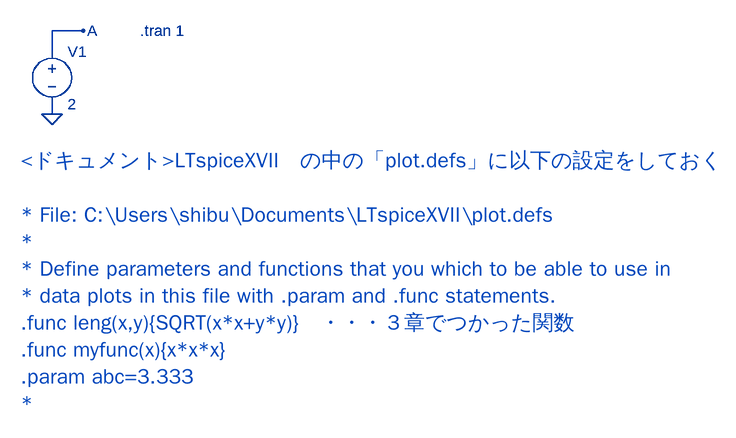
[diagram p0: schematic Fig_4-13_myfunc.asc]
Fig_4-13_myfunc.asc, the LTspice schematic file:
Version 4
SHEET 1 1356 680
WIRE 192 112 144 112
WIRE 144 144 144 112
WIRE 144 240 144 224
FLAG 144 240 0
FLAG 192 112 A
SYMBOL voltage 144 128 R0
WINDOW 3 24 97 Left 2
WINDOW 123 0 0 Left 0
WINDOW 39 0 0 Left 0
SYMATTR Value 2
SYMATTR InstName V1
TEXT 96 312 Left 3 ;<ドキュメント>LTspiceXVII　の中の「plot.defs」に以下の設定をしておく\n \n* File: C:\\Users\\shibu\\Documents\\LTspiceXVII\\plot.defs\n*\n* Define parameters and functions that you which to be able to use in\n* data plots in this file with .param and .func statements.\n.func leng(x,y){SQRT(x*x+y*y)}　・・・３章でつかった関数\n.func myfunc(x){x*x*x}\n.param abc=3.333\n*
TEXT 280 112 Left 2 !.tran 1

The netlist it stands for:
* Fig_4-13_myfunc.asc
V1 A 0 2
* <ドキュメント>LTspiceXVII　の中の「plot.defs」に以下の設定をしておく
* * File: C:\Users\shibu\Documents\LTspiceXVII\plot.defs
* *
* * Define parameters and functions that you which to be able to use in
* * data plots in this file with .param and .func statements.
* .func leng(x,y){SQRT(x*x+y*y)}　・・・３章でつかった関数
* .func myfunc(x){x*x*x}
* .param abc=3.333
* *
.tran 1
.backanno
.end